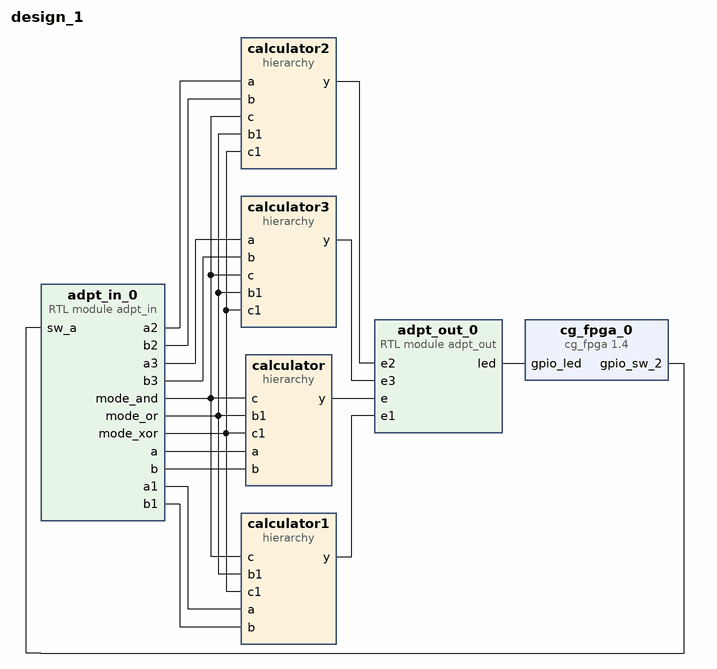
[diagram p0: block diagram of the top level]
# Vivado block design design_1, xc7z020clg400-1, Vivado 2024.2
create_bd_design design_1

create_bd_cell -type ip -vlnv educg.net:user:cg_fpga:1.4 cg_fpga_0
create_bd_cell -type module -reference adpt_in adpt_in_0
create_bd_cell -type module -reference adpt_out adpt_out_0
create_bd_cell -type hier calculator
create_bd_cell -type hier calculator1
create_bd_cell -type hier calculator2
create_bd_cell -type hier calculator3

# ---- hierarchy /calculator ----
current_bd_instance /calculator
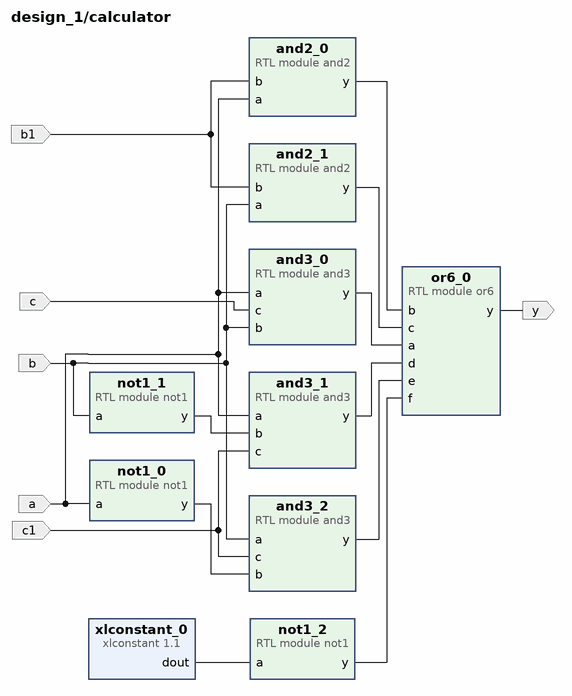
[diagram p1: block diagram inside /calculator]
create_bd_pin -dir I a
create_bd_pin -dir I b
create_bd_pin -dir I c
create_bd_pin -dir I b1
create_bd_pin -dir I c1
create_bd_pin -dir O y

create_bd_cell -type module -reference not1 not1_0
create_bd_cell -type module -reference not1 not1_1
create_bd_cell -type module -reference and3 and3_0
create_bd_cell -type module -reference and2 and2_0
create_bd_cell -type module -reference and2 and2_1
create_bd_cell -type module -reference and3 and3_1
create_bd_cell -type module -reference and3 and3_2
create_bd_cell -type ip -vlnv xilinx.com:ip:xlconstant:1.1 xlconstant_0
create_bd_cell -type module -reference not1 not1_2
create_bd_cell -type module -reference or6 or6_0

# ---- hierarchy /calculator1 ----
current_bd_instance /calculator1
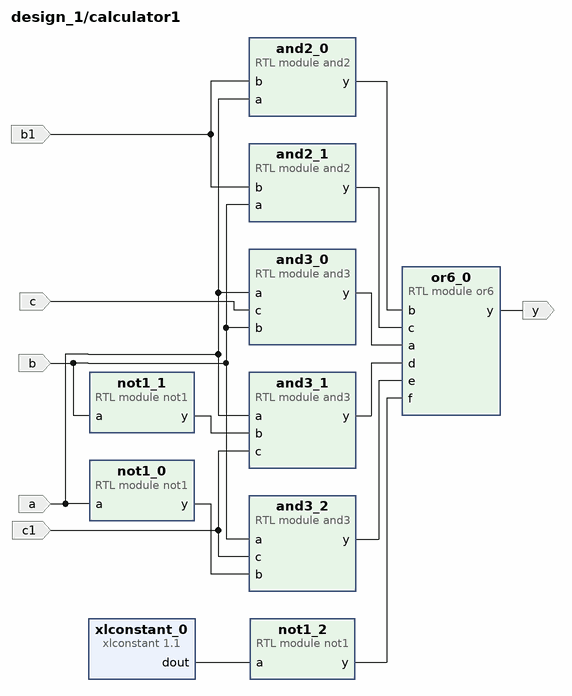
[diagram p2: block diagram inside /calculator1]
create_bd_pin -dir I a
create_bd_pin -dir I b
create_bd_pin -dir I c
create_bd_pin -dir I b1
create_bd_pin -dir I c1
create_bd_pin -dir O y

create_bd_cell -type module -reference not1 not1_0
create_bd_cell -type module -reference not1 not1_1
create_bd_cell -type module -reference and3 and3_0
create_bd_cell -type module -reference and2 and2_0
create_bd_cell -type module -reference and2 and2_1
create_bd_cell -type module -reference and3 and3_1
create_bd_cell -type module -reference and3 and3_2
create_bd_cell -type ip -vlnv xilinx.com:ip:xlconstant:1.1 xlconstant_0
create_bd_cell -type module -reference not1 not1_2
create_bd_cell -type module -reference or6 or6_0

# ---- hierarchy /calculator2 ----
current_bd_instance /calculator2
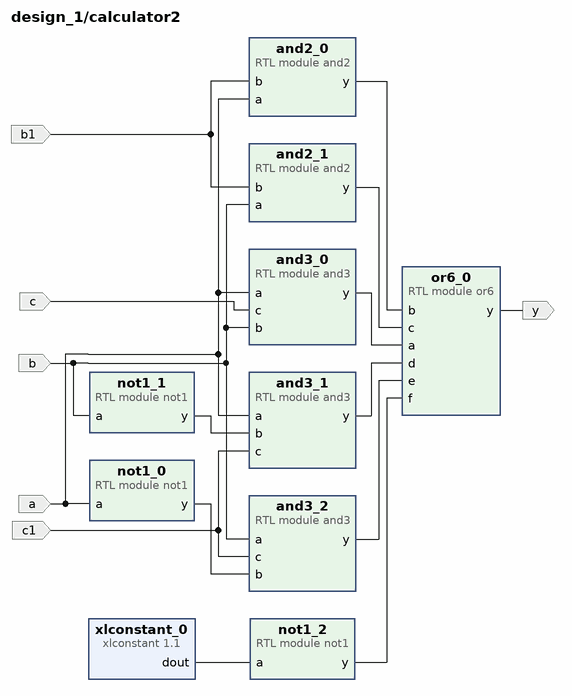
[diagram p3: block diagram inside /calculator2]
create_bd_pin -dir I a
create_bd_pin -dir I b
create_bd_pin -dir I c
create_bd_pin -dir I b1
create_bd_pin -dir I c1
create_bd_pin -dir O y

create_bd_cell -type module -reference not1 not1_0
create_bd_cell -type module -reference not1 not1_1
create_bd_cell -type module -reference and3 and3_0
create_bd_cell -type module -reference and2 and2_0
create_bd_cell -type module -reference and2 and2_1
create_bd_cell -type module -reference and3 and3_1
create_bd_cell -type module -reference and3 and3_2
create_bd_cell -type ip -vlnv xilinx.com:ip:xlconstant:1.1 xlconstant_0
create_bd_cell -type module -reference not1 not1_2
create_bd_cell -type module -reference or6 or6_0

# ---- hierarchy /calculator3 ----
current_bd_instance /calculator3
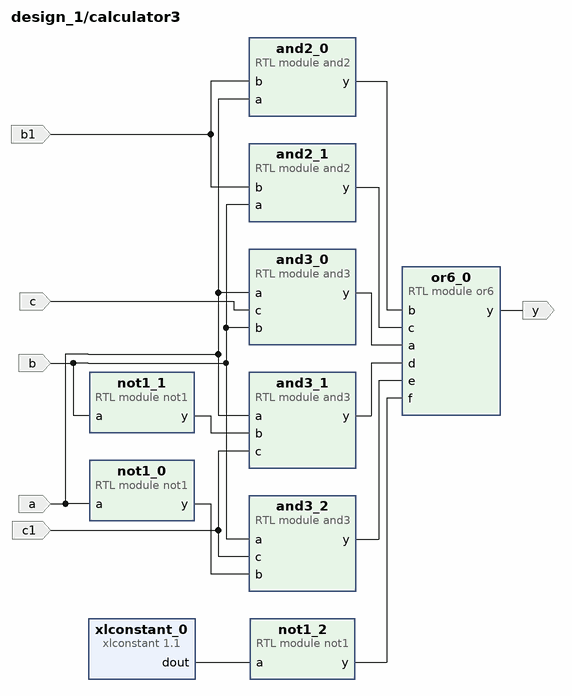
[diagram p4: block diagram inside /calculator3]
create_bd_pin -dir I a
create_bd_pin -dir I b
create_bd_pin -dir I c
create_bd_pin -dir I b1
create_bd_pin -dir I c1
create_bd_pin -dir O y

create_bd_cell -type module -reference not1 not1_0
create_bd_cell -type module -reference not1 not1_1
create_bd_cell -type module -reference and3 and3_0
create_bd_cell -type module -reference and2 and2_0
create_bd_cell -type module -reference and2 and2_1
create_bd_cell -type module -reference and3 and3_1
create_bd_cell -type module -reference and3 and3_2
create_bd_cell -type ip -vlnv xilinx.com:ip:xlconstant:1.1 xlconstant_0
create_bd_cell -type module -reference not1 not1_2
create_bd_cell -type module -reference or6 or6_0

# ---- connections ----

current_bd_instance /calculator
connect_bd_net -net adpt_in_0_a [get_bd_pins a] [get_bd_pins and3_0/a] [get_bd_pins and2_0/a] [get_bd_pins and3_1/a] [get_bd_pins not1_0/a]
connect_bd_net -net adpt_in_0_b [get_bd_pins b] [get_bd_pins and3_0/b] [get_bd_pins and2_1/a] [get_bd_pins and3_2/a] [get_bd_pins not1_1/a]
connect_bd_net -net adpt_in_0_mode_and [get_bd_pins c] [get_bd_pins and3_0/c]
connect_bd_net -net adpt_in_0_mode_or [get_bd_pins b1] [get_bd_pins and2_1/b] [get_bd_pins and2_0/b]
connect_bd_net -net adpt_in_0_mode_xor [get_bd_pins c1] [get_bd_pins and3_2/c] [get_bd_pins and3_1/c]
connect_bd_net [get_bd_pins and2_0/y] [get_bd_pins or6_0/b]
connect_bd_net [get_bd_pins and2_1/y] [get_bd_pins or6_0/c]
connect_bd_net [get_bd_pins and3_0/y] [get_bd_pins or6_0/a]
connect_bd_net [get_bd_pins and3_1/y] [get_bd_pins or6_0/d]
connect_bd_net [get_bd_pins and3_2/y] [get_bd_pins or6_0/e]
connect_bd_net [get_bd_pins not1_0/y] [get_bd_pins and3_2/b]
connect_bd_net [get_bd_pins not1_1/y] [get_bd_pins and3_1/b]
connect_bd_net [get_bd_pins not1_2/y] [get_bd_pins or6_0/f]
connect_bd_net [get_bd_pins or6_0/y] [get_bd_pins y]
connect_bd_net [get_bd_pins xlconstant_0/dout] [get_bd_pins not1_2/a]

current_bd_instance /calculator1
connect_bd_net -net adpt_in_0_a [get_bd_pins a] [get_bd_pins and3_0/a] [get_bd_pins and2_0/a] [get_bd_pins and3_1/a] [get_bd_pins not1_0/a]
connect_bd_net -net adpt_in_0_b [get_bd_pins b] [get_bd_pins and3_0/b] [get_bd_pins and2_1/a] [get_bd_pins and3_2/a] [get_bd_pins not1_1/a]
connect_bd_net -net adpt_in_0_mode_and [get_bd_pins c] [get_bd_pins and3_0/c]
connect_bd_net -net adpt_in_0_mode_or [get_bd_pins b1] [get_bd_pins and2_1/b] [get_bd_pins and2_0/b]
connect_bd_net -net adpt_in_0_mode_xor [get_bd_pins c1] [get_bd_pins and3_2/c] [get_bd_pins and3_1/c]
connect_bd_net [get_bd_pins and2_0/y] [get_bd_pins or6_0/b]
connect_bd_net [get_bd_pins and2_1/y] [get_bd_pins or6_0/c]
connect_bd_net [get_bd_pins and3_0/y] [get_bd_pins or6_0/a]
connect_bd_net [get_bd_pins and3_1/y] [get_bd_pins or6_0/d]
connect_bd_net [get_bd_pins and3_2/y] [get_bd_pins or6_0/e]
connect_bd_net [get_bd_pins not1_0/y] [get_bd_pins and3_2/b]
connect_bd_net [get_bd_pins not1_1/y] [get_bd_pins and3_1/b]
connect_bd_net [get_bd_pins not1_2/y] [get_bd_pins or6_0/f]
connect_bd_net [get_bd_pins or6_0/y] [get_bd_pins y]
connect_bd_net [get_bd_pins xlconstant_0/dout] [get_bd_pins not1_2/a]

current_bd_instance /calculator2
connect_bd_net -net adpt_in_0_a [get_bd_pins a] [get_bd_pins and3_0/a] [get_bd_pins and2_0/a] [get_bd_pins and3_1/a] [get_bd_pins not1_0/a]
connect_bd_net -net adpt_in_0_b [get_bd_pins b] [get_bd_pins and3_0/b] [get_bd_pins and2_1/a] [get_bd_pins and3_2/a] [get_bd_pins not1_1/a]
connect_bd_net -net adpt_in_0_mode_and [get_bd_pins c] [get_bd_pins and3_0/c]
connect_bd_net -net adpt_in_0_mode_or [get_bd_pins b1] [get_bd_pins and2_1/b] [get_bd_pins and2_0/b]
connect_bd_net -net adpt_in_0_mode_xor [get_bd_pins c1] [get_bd_pins and3_2/c] [get_bd_pins and3_1/c]
connect_bd_net [get_bd_pins and2_0/y] [get_bd_pins or6_0/b]
connect_bd_net [get_bd_pins and2_1/y] [get_bd_pins or6_0/c]
connect_bd_net [get_bd_pins and3_0/y] [get_bd_pins or6_0/a]
connect_bd_net [get_bd_pins and3_1/y] [get_bd_pins or6_0/d]
connect_bd_net [get_bd_pins and3_2/y] [get_bd_pins or6_0/e]
connect_bd_net [get_bd_pins not1_0/y] [get_bd_pins and3_2/b]
connect_bd_net [get_bd_pins not1_1/y] [get_bd_pins and3_1/b]
connect_bd_net [get_bd_pins not1_2/y] [get_bd_pins or6_0/f]
connect_bd_net [get_bd_pins or6_0/y] [get_bd_pins y]
connect_bd_net [get_bd_pins xlconstant_0/dout] [get_bd_pins not1_2/a]

current_bd_instance /calculator3
connect_bd_net -net adpt_in_0_a [get_bd_pins a] [get_bd_pins and3_0/a] [get_bd_pins and2_0/a] [get_bd_pins and3_1/a] [get_bd_pins not1_0/a]
connect_bd_net -net adpt_in_0_b [get_bd_pins b] [get_bd_pins and3_0/b] [get_bd_pins and2_1/a] [get_bd_pins and3_2/a] [get_bd_pins not1_1/a]
connect_bd_net -net adpt_in_0_mode_and [get_bd_pins c] [get_bd_pins and3_0/c]
connect_bd_net -net adpt_in_0_mode_or [get_bd_pins b1] [get_bd_pins and2_1/b] [get_bd_pins and2_0/b]
connect_bd_net -net adpt_in_0_mode_xor [get_bd_pins c1] [get_bd_pins and3_2/c] [get_bd_pins and3_1/c]
connect_bd_net [get_bd_pins and2_0/y] [get_bd_pins or6_0/b]
connect_bd_net [get_bd_pins and2_1/y] [get_bd_pins or6_0/c]
connect_bd_net [get_bd_pins and3_0/y] [get_bd_pins or6_0/a]
connect_bd_net [get_bd_pins and3_1/y] [get_bd_pins or6_0/d]
connect_bd_net [get_bd_pins and3_2/y] [get_bd_pins or6_0/e]
connect_bd_net [get_bd_pins not1_0/y] [get_bd_pins and3_2/b]
connect_bd_net [get_bd_pins not1_1/y] [get_bd_pins and3_1/b]
connect_bd_net [get_bd_pins not1_2/y] [get_bd_pins or6_0/f]
connect_bd_net [get_bd_pins or6_0/y] [get_bd_pins y]
connect_bd_net [get_bd_pins xlconstant_0/dout] [get_bd_pins not1_2/a]

current_bd_instance /
connect_bd_net -net a_1 [get_bd_pins adpt_in_0/a2] [get_bd_pins calculator2/a]
connect_bd_net [get_bd_pins adpt_in_0/a] [get_bd_pins calculator/a]
connect_bd_net [get_bd_pins adpt_in_0/a1] [get_bd_pins calculator1/a]
connect_bd_net [get_bd_pins adpt_in_0/a3] [get_bd_pins calculator3/a]
connect_bd_net [get_bd_pins adpt_in_0/b] [get_bd_pins calculator/b]
connect_bd_net [get_bd_pins adpt_in_0/b1] [get_bd_pins calculator1/b]
connect_bd_net [get_bd_pins adpt_in_0/b2] [get_bd_pins calculator2/b]
connect_bd_net [get_bd_pins adpt_in_0/b3] [get_bd_pins calculator3/b]
connect_bd_net [get_bd_pins adpt_in_0/mode_and] \
  [get_bd_pins calculator/c] [get_bd_pins calculator1/c] [get_bd_pins calculator2/c] [get_bd_pins calculator3/c]
connect_bd_net [get_bd_pins adpt_in_0/mode_or] \
  [get_bd_pins calculator/b1] [get_bd_pins calculator1/b1] [get_bd_pins calculator2/b1] [get_bd_pins calculator3/b1]
connect_bd_net [get_bd_pins adpt_in_0/mode_xor] \
  [get_bd_pins calculator/c1] [get_bd_pins calculator1/c1] [get_bd_pins calculator2/c1] [get_bd_pins calculator3/c1]
connect_bd_net [get_bd_pins adpt_out_0/led] [get_bd_pins cg_fpga_0/gpio_led]
connect_bd_net [get_bd_pins calculator1/y] [get_bd_pins adpt_out_0/e1]
connect_bd_net [get_bd_pins calculator2/y] [get_bd_pins adpt_out_0/e2]
connect_bd_net [get_bd_pins calculator3/y] [get_bd_pins adpt_out_0/e3]
connect_bd_net [get_bd_pins cg_fpga_0/gpio_sw_2] [get_bd_pins adpt_in_0/sw_a]
connect_bd_net -net or6_0_y [get_bd_pins calculator/y] [get_bd_pins adpt_out_0/e]

validate_bd_design
save_bd_design
